# Altium schematic sheet Color_Sensing.SchDoc
size 381 x 241 mm
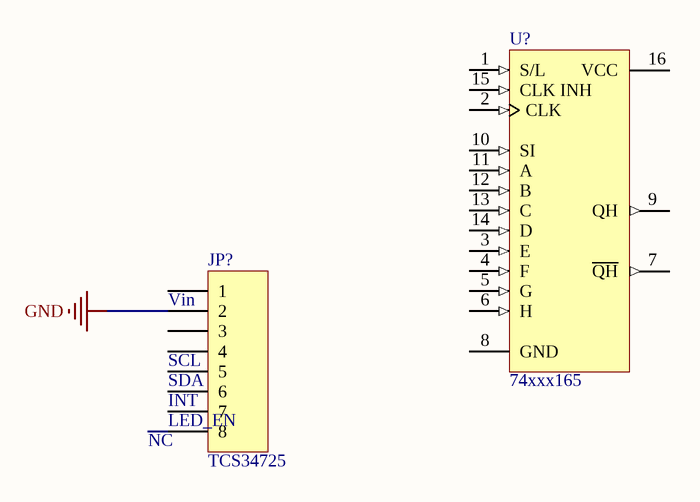
[diagram p0: Color_Sensing.SchDoc]

## Parts
JP?  TCS34725  [HDR1X8]
U?  74xxx165  [CDFP-G16/E7]

## Nets
GND: JP?.2

Not connected (* = marked no-connect by the designer): JP? 1 3 4 5 6 7 8; U? 1(S/L) 2(CLK) 3(E) 4(F) 5(G) 6(H) 7(~{QH}) 8(GND) 9(QH) 10(SI) 11(A) 12(B) 13(C) 14(D) 15(CLK_INH) 16(VCC)

## Notes on the sheet
- (near JP?) Vin
- (near JP?) NC
- (near JP?) SCL
- (near JP?) SDA
- (near JP?) INT
- (near JP?) LED_EN

## Library data of the parts
JP? = Molex8: Header, 8-Pin; Manufacturer: Generic Components; Class: Connector
U? = 74xxx165: 8-Bit Parallel In/Serial Output Shift Register; Manufacturer: Fairchild Semiconductor; Class: Logic; Note: Generic simulation model provided.; Published: 15/04/2002; Publisher: Altium Hobart Technology Centre; SubClass: Register